# EAGLE design EXT_SCR (EAGLE 6.5.0)
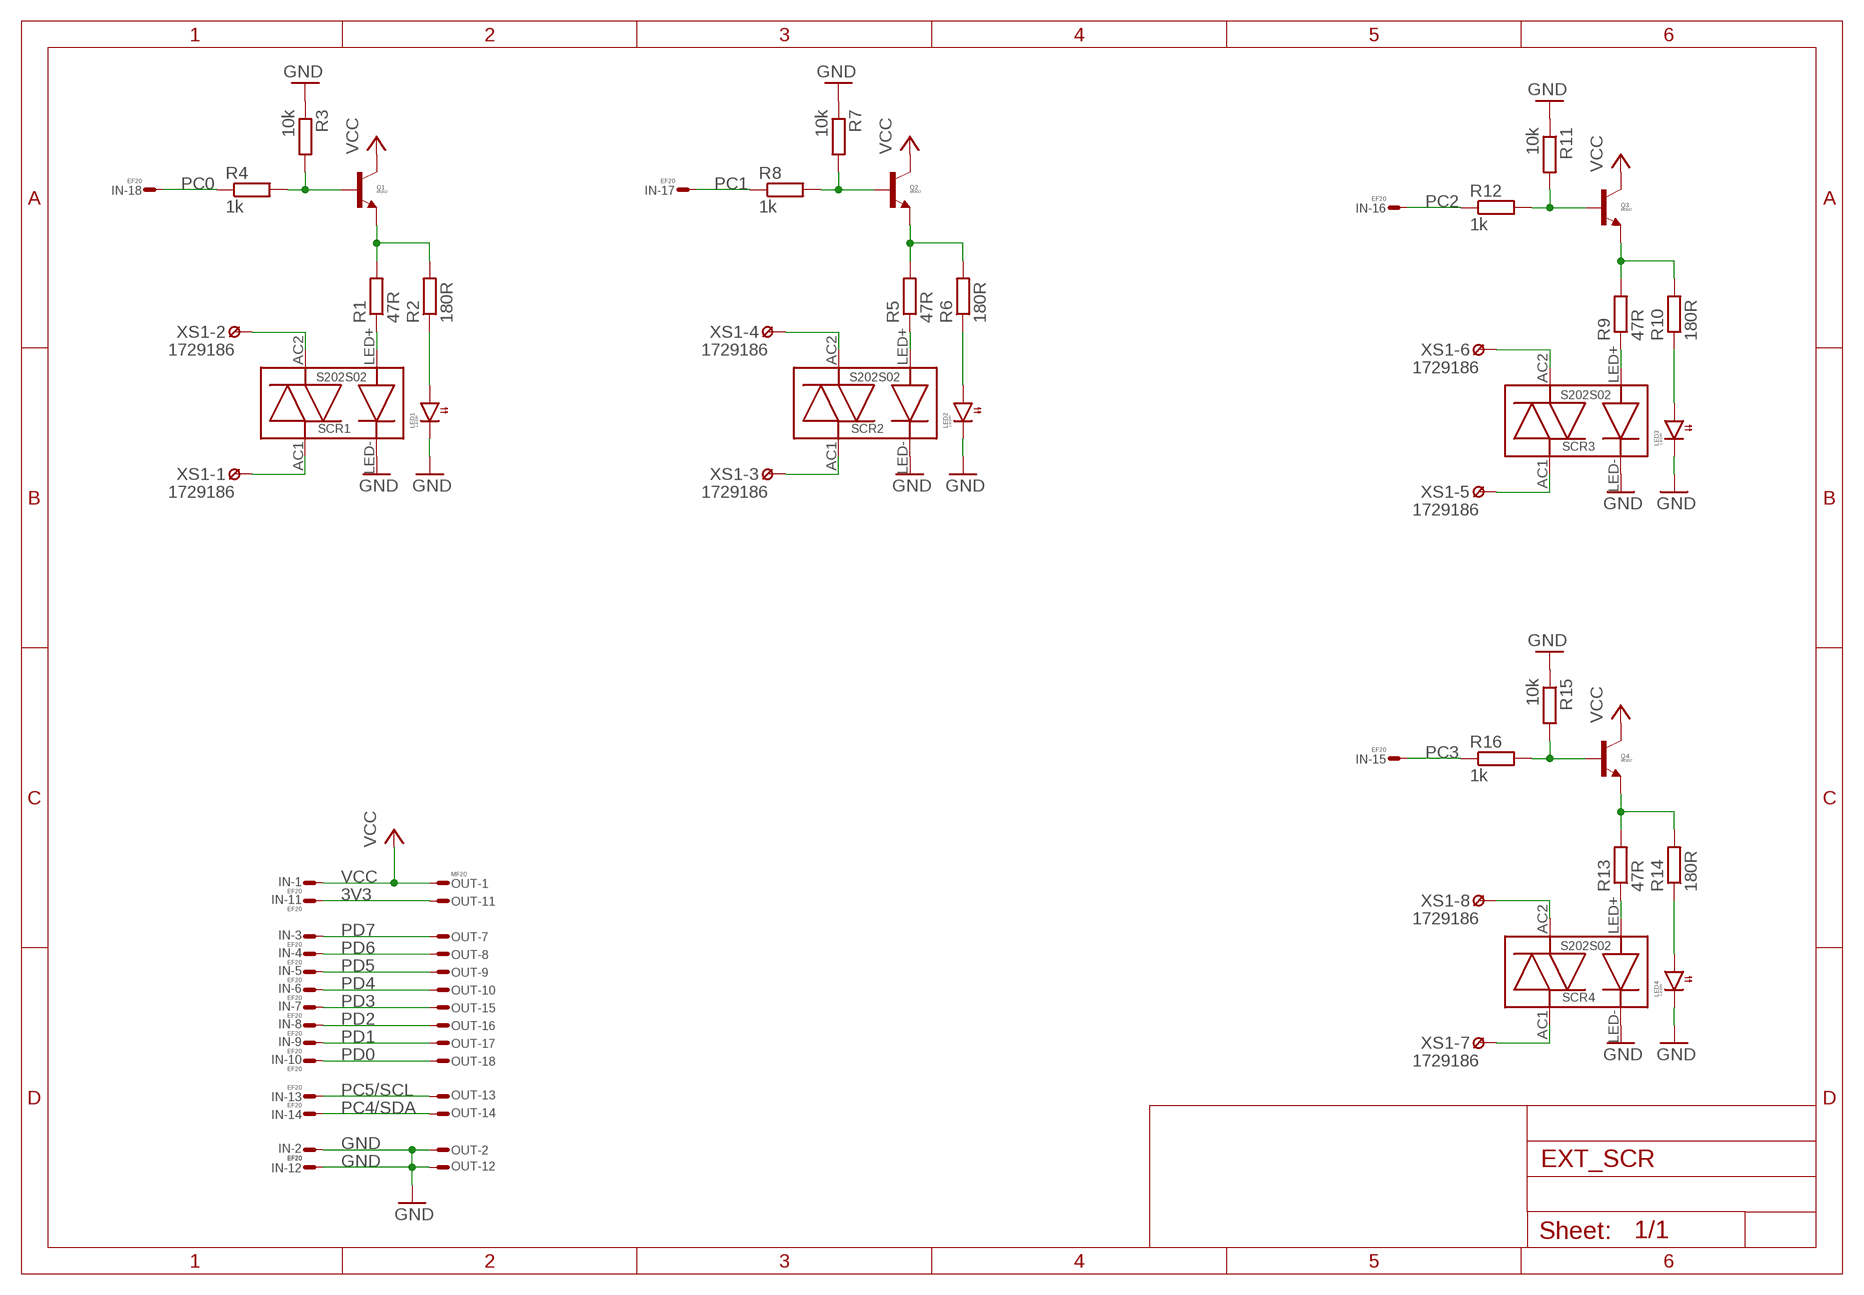
[diagram p0: schematic, sheet 1]

## Parts
IN  EF20  FE20ELSS  [FE10-2WSS]
LED1  LEDR  LED1206  [1206]
LED2  LEDR  LED1206  [1206]
LED3  LEDR  LED1206  [1206]
LED4  LEDR  LED1206  [1206]
OUT  MF20  ML20LSE  [ML20LS]
Q1  BC817  NPN23  [SOT23]
Q2  BC817  NPN23  [SOT23]
Q3  BC817  NPN23  [SOT23]
Q4  BC817  NPN23  [SOT23]
R1  47R  R0603  [0603]
R2  180R  R0603  [0603]
R3  10k  R0603  [0603]
R4  1k  R0603  [0603]
R5  47R  R0603  [0603]
R6  180R  R0603  [0603]
R7  10k  R0603  [0603]
R8  1k  R0603  [0603]
R9  47R  R0603  [0603]
R10  180R  R0603  [0603]
R11  10k  R0603  [0603]
R12  1k  R0603  [0603]
R13  47R  R0603  [0603]
R14  180R  R0603  [0603]
R15  10k  R0603  [0603]
R16  1k  R0603  [0603]
SCR1  S202S02  S202  [S202]
SCR2  S202S02  S202  [S202]
SCR3  S202S02  S202  [S202]
SCR4  S202S02  S202  [S202]
XS1  1729186  CON8-SS508  [W237-8P]

## Nets
3V3: IN.P$11 OUT.P$11
GND: IN.P$2 IN.P$12 LED1.2(C) LED2.2(C) LED3.2(C) LED4.2(C) OUT.P$2 OUT.P$12 R3.1 R7.1 R11.1 R15.1 SCR1.LED-(L-) SCR2.LED-(L-) SCR3.LED-(L-) SCR4.LED-(L-)
N$1: R1.1 SCR1.LED+(L+)
N$2: LED1.1(A) R2.1
N$3: Q1.2(E) R1.2 R2.2
N$4: Q1.1(B) R3.2 R4.2
N$5: R5.1 SCR2.LED+(L+)
N$6: LED2.1(A) R6.1
N$7: Q2.2(E) R5.2 R6.2
N$8: Q2.1(B) R7.2 R8.2
N$9: R9.1 SCR3.LED+(L+)
N$10: LED3.1(A) R10.1
N$11: Q3.2(E) R9.2 R10.2
N$12: Q3.1(B) R11.2 R12.2
N$13: R13.1 SCR4.LED+(L+)
N$14: LED4.1(A) R14.1
N$15: Q4.2(E) R13.2 R14.2
N$16: Q4.1(B) R15.2 R16.2
N$17: SCR1.AC1 XS1.1
N$18: SCR1.AC2 XS1.2
N$19: SCR2.AC1 XS1.3
N$20: SCR2.AC2 XS1.4
N$21: SCR3.AC1 XS1.5
N$22: SCR3.AC2 XS1.6
N$23: SCR4.AC2 XS1.8
N$24: SCR4.AC1 XS1.7
PC0: IN.P$18 R4.1
PC1: IN.P$17 R8.1
PC2: IN.P$16 R12.1
PC3: IN.P$15 R16.1
PC4/SDA: IN.P$14 OUT.P$14
PC5/SCL: IN.P$13 OUT.P$13
PD0: IN.P$10 OUT.P$18
PD1: IN.P$9 OUT.P$17
PD2: IN.P$8 OUT.P$16
PD3: IN.P$7 OUT.P$15
PD4: IN.P$6 OUT.P$10
PD5: IN.P$5 OUT.P$9
PD6: IN.P$4 OUT.P$8
PD7: IN.P$3 OUT.P$7
VCC: IN.P$1 OUT.P$1 Q1.3(C) Q2.3(C) Q3.3(C) Q4.3(C)
Unconnected: IN.P$19 IN.P$20 OUT.P$3 OUT.P$4 OUT.P$5 OUT.P$6 OUT.P$19 OUT.P$20

## Library data of the parts
IN = Conn:FE20E
LED1-LED4 = Optic:LED
OUT = Conn:ML20?E: HARTING
Q1-Q4 = Transistor:NPN
R1-R16 = RCL:R: Resistor SMD
SCR1-SCR4 = Relay_Switch:S202
XS1 = Conn:CON8-S

## Board
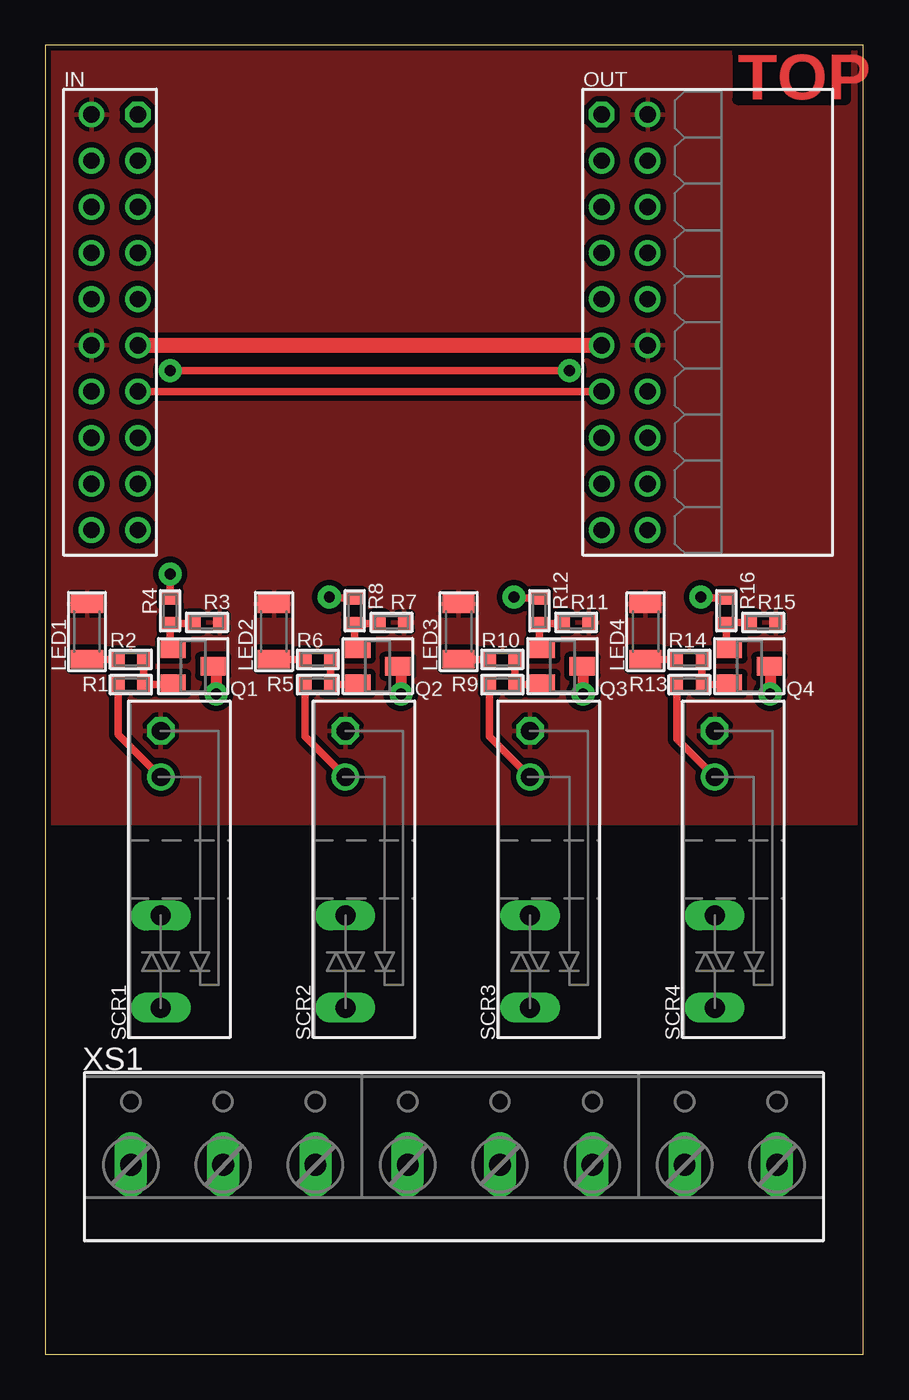
[diagram p1: board, top side]
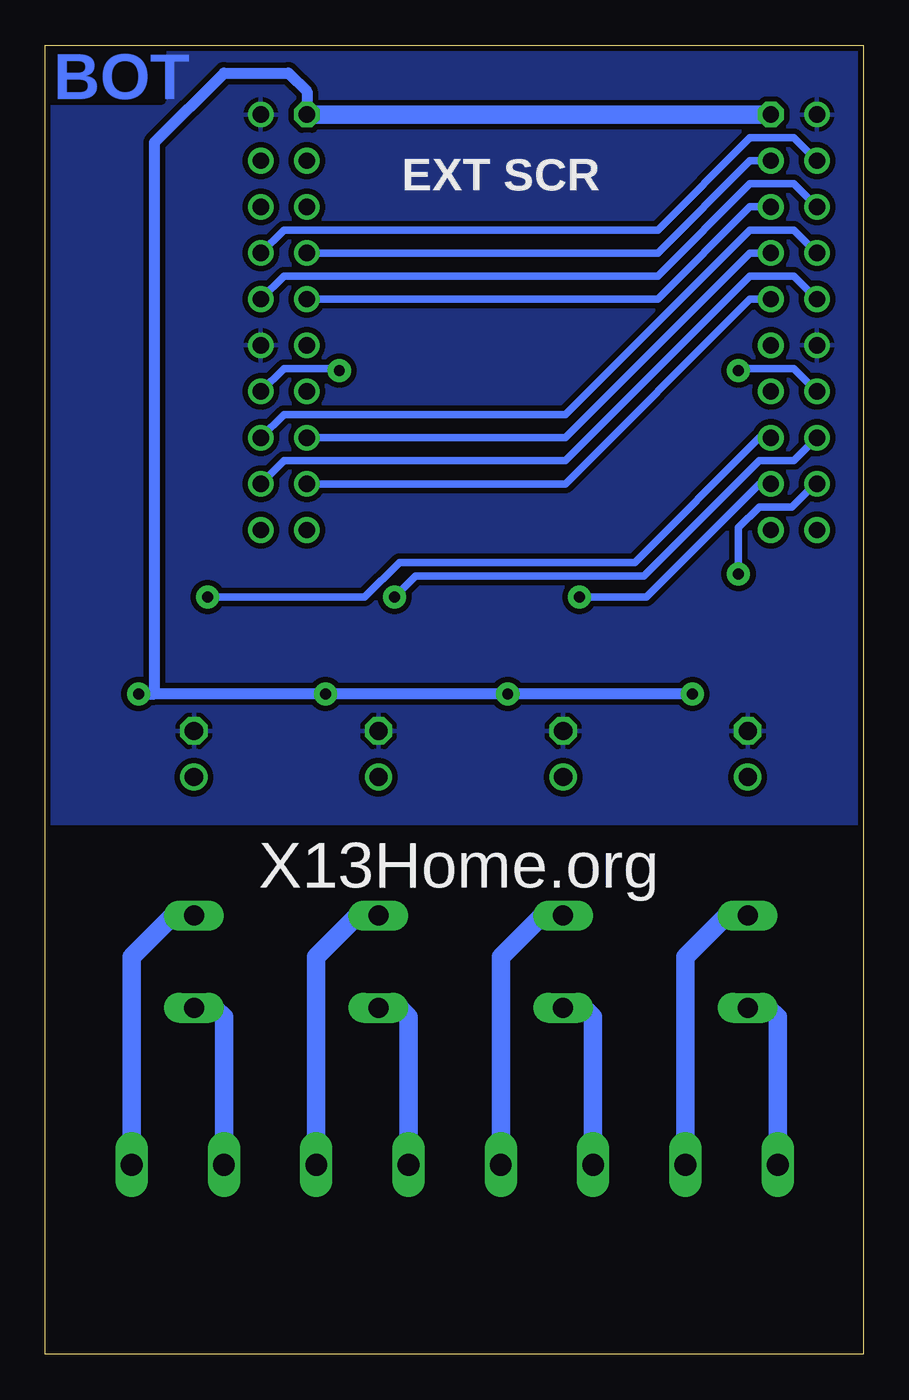
[diagram p2: board, bottom side, seen from below]

Size 45 x 72 mm. Coordinates in mm from the lower left corner, seen from the top.
Outline: 0,0 45,0 45,72 0,72 0,0
Copper layers (1*16): Top 0.035mm / dielectric 1.5mm / Bottom 0.035mm
Design rules "default *": minimum track width 10mil, minimum drill 10mil, track to track 12mil, track to pad 12mil, pad to pad 12mil, via to via 12mil, smd to smd 12mil, copper to edge 12mil, drill to drill 8mil, minimum pad ring 10mil, minimum via ring 8mil, stop-mask expansion 4mil, vias tented up to drill 0mil, thermal gap 10mil
tKeepout: area 0,0 to 45,2; area 0,70 to 45,72

### Footprints (pad centres in the part's own frame; a part is rotated, then mirrored left to right if it is on the bottom)
FE10-2WSS = drill 0.9 octagon: P$1 -11.43,1.27 | drill 0.9: P$2 -11.43,-1.27; P$3 -8.89,1.27; P$4 -8.89,-1.27; P$5 -6.35,1.27; P$6 -6.35,-1.27; P$7 -3.81,1.27; P$8 -3.81,-1.27; P$9 -1.27,1.27; P$10 -1.27,-1.27; P$11 1.27,1.27; P$12 1.27,-1.27; P$13 3.81,1.27; P$14 3.81,-1.27; P$15 6.35,1.27; P$16 6.35,-1.27; P$17 8.89,1.27; P$18 8.89,-1.27; P$19 11.43,1.27; P$20 11.43,-1.27
1206 = smd 1.016 x 1.778: 1 -1.524,0; 2 1.524,0
ML20LS = drill 0.9 octagon: P$1 -11.43,-1.27 | drill 0.9: P$2 -11.43,1.27; P$3 -8.89,-1.27; P$4 -8.89,1.27; P$5 -6.35,-1.27; P$6 -6.35,1.27; P$7 -3.81,-1.27; P$8 -3.81,1.27; P$9 -1.27,-1.27; P$10 -1.27,1.27; P$11 1.27,-1.27; P$12 1.27,1.27; P$13 3.81,-1.27; P$14 3.81,1.27; P$15 6.35,-1.27; P$16 6.35,1.27; P$17 8.89,-1.27; P$18 8.89,1.27; P$19 11.43,-1.27; P$20 11.43,1.27
SOT23 = smd 1 x 1.4: 1 -0.95,-1.1; 2 0.95,-1.1; 3 0,1.1
0603 = smd 0.7 x 0.9: 1 -0.697,0; 2 0.697,0
S202 = drill 1.1 long: AC1 -7.62,0; AC2 -2.54,0 | drill 1: LED+ 5.08,0 | drill 1 octagon: LED- 7.62,0
W237-8P = drill 1.194 long: 1 -17.78,-0.635; 2 -12.7,-0.635; 3 -7.62,-0.635; 4 -2.54,-0.635; 5 2.54,-0.635; 6 7.62,-0.635; 7 12.7,-0.635; 8 17.78,-0.635

### Placement (x,y rotation side)
IN  3.81,56.77 270 top
LED1  2.29,39.75 90 top
LED2  12.57,39.75 90 top
LED3  22.73,39.75 90 top
LED4  33.02,39.75 90 top
OUT  31.88,56.77 270 top
Q1  8.13,37.85 270 top
Q2  18.29,37.85 270 top
Q3  28.45,37.85 270 top
Q4  38.73,37.85 270 top
R1  4.7,36.83 0 top
R2  4.7,38.23 0 top
R3  8.89,40.26 180 top
R4  6.86,40.89 270 top
R5  14.99,36.83 0 top
R6  14.99,38.23 0 top
R7  19.05,40.26 180 top
R8  17.02,40.89 270 top
R9  25.15,36.83 0 top
R10  25.15,38.23 0 top
R11  29.21,40.26 180 top
R12  27.18,40.89 270 top
R13  35.43,36.83 0 top
R14  35.43,38.23 0 top
R15  39.5,40.26 180 top
R16  37.47,40.89 270 top
SCR1  6.35,26.67 90 top
SCR2  16.51,26.67 90 top
SCR3  26.67,26.67 90 top
SCR4  36.83,26.67 90 top
XS1  22.48,11.05 0 top

### Tracks (layer width: path | path; a pad name or v marks a point on that pad's centre or on a via)
3V3
  Top 0.813: IN.P$11 OUT.P$11
GND
  pour Bottom: 0,29.21 45,29.21 45,72 0,72
  pour Top: 0,29.21 45,29.21 45,72 0,72
N$1
  Top 0.406: R1.1 4,34.1 SCR1.LED+
N$2
  Top 0.406: R2.1 LED1.1
N$3
  Top 0.406: Q1.2 6.96,36.83 R1.2 R2.2
N$4
  Top 0.406: Q1.1 6.86,38.97 R4.2 8.13,40.2 R3.2
N$5
  Top 0.406: R5.1 14.29,33.97 SCR2.LED+
N$6
  Top 0.406: R6.1 LED2.1
N$7
  Top 0.406: R6.2 R5.2 17.12,36.83 Q2.2
N$8
  Top 0.406: Q2.1 17.02,38.97 R8.2 18.29,40.2 R7.2
N$9
  Top 0.406: R9.1 24.45,33.97 SCR3.LED+
N$10
  Top 0.406: LED3.1 R10.1
N$11
  Top 0.406: R10.2 R9.2 27.28,36.83 Q3.2
N$12
  Top 0.406: Q3.1 27.18,38.97 R12.2 28.45,40.2 R11.2
N$13
  Top 0.406: R13.1 34.74,33.84 SCR4.LED+
N$14
  Top 0.406: R14.1 LED4.1
N$15
  Top 0.406: R14.2 R13.2 37.57,36.83 Q4.2
N$16
  Top 0.406: R15.2 37.53,40.26 R16.2 37.47,38.97 Q4.1
N$17
  Bottom 1.016: XS1.1 4.7,18.54 5.21,19.05 SCR1.AC1
N$18
  Bottom 1.016: XS1.2 9.78,21.84 7.49,24.13 SCR1.AC2
N$19
  Bottom 1.016: XS1.3 14.86,18.54 15.37,19.05 SCR2.AC1
N$20
  Bottom 1.016: XS1.4 19.94,21.84 17.65,24.13 SCR2.AC2
N$21
  Bottom 1.016: XS1.5 25.02,18.54 25.53,19.05 SCR3.AC1
N$22
  Bottom 1.016: XS1.6 30.1,21.84 27.81,24.13 SCR3.AC2
N$23
  Bottom 1.016: XS1.8 40.26,21.84 37.97,24.13 SCR4.AC2
N$24
  Bottom 1.016: XS1.7 35.18,18.54 35.69,19.05 SCR4.AC1
PC0  (via drill 0.6 pad 1.27)
  Top 0.406: v6.86,42.93 R4.1
  Bottom 0.406: IN.P$18 2.67,47.88 3.94,46.61 5.71,46.61 6.86,45.47 v6.86,42.93
PC1  (via drill 0.6 pad 1.27)
  Top 0.406: R8.1 15.69,41.59 v15.62,41.66
  Bottom 0.406: v15.62,41.66 11.94,41.66 5.71,47.88 IN.P$17
PC2  (via drill 0.6 pad 1.27)
  Top 0.406: R12.1 25.85,41.59 v25.78,41.66
  Bottom 0.406: v25.78,41.66 24.64,42.8 12.06,42.8 5.71,49.15 3.81,49.15 IN.P$16
PC3  (via drill 0.6 pad 1.27)
  Top 0.406: R16.1 36.13,41.59 v36.07,41.66
  Bottom 0.406: IN.P$15 5.71,50.42 12.57,43.56 25.53,43.56 27.43,41.66 v36.07,41.66
PC4/SDA  (via drill 0.6 pad 1.27)
  Top 0.406: v6.86,54.1 v28.83,54.1
  Bottom 0.406: IN.P$14 3.81,54.23 6.73,54.23 v6.86,54.1 | OUT.P$14 31.88,54.23 28.96,54.23 v28.83,54.1
PC5/SCL
  Top 0.406: IN.P$13 OUT.P$13
PD0
  Bottom 0.406: IN.P$10 3.81,59.31 6.22,59.31 16.38,49.15 31.88,49.15 OUT.P$18
PD1
  Bottom 0.406: IN.P$9 6.22,58.04 16.38,47.88 OUT.P$17
PD2
  Bottom 0.406: IN.P$8 3.81,61.85 6.22,61.85 16.38,51.69 31.88,51.69 OUT.P$16
PD3
  Bottom 0.406: IN.P$7 6.22,60.58 16.38,50.42 OUT.P$15
PD4
  Bottom 0.406: IN.P$6 3.81,64.39 6.22,64.39 11.3,59.31 31.88,59.31 OUT.P$10
PD5
  Bottom 0.406: IN.P$5 6.22,63.12 11.3,58.04 OUT.P$9
PD6
  Bottom 0.406: IN.P$4 3.81,66.93 6.22,66.93 11.3,61.85 31.88,61.85 OUT.P$8
PD7
  Bottom 0.406: IN.P$3 6.22,65.66 11.3,60.58 OUT.P$7
VCC  (via drill 0.6 pad 1.27)
  Top 0.406: Q1.3 9.4,37.85 | Q2.3 19.56,37.85 | Q3.3 29.59,37.85 | Q4.3 39.88,37.85
  Top 0.61: 9.4,37.85 v9.4,36.32 | 19.56,37.85 v19.56,36.32 | 29.59,37.85 v29.59,36.32 | 39.88,37.85 v39.88,36.32
  Bottom 0.61: v9.4,36.32 v19.56,36.32 v29.59,36.32 38.99,36.32 | OUT.P$1 30.61,69.47 31.62,70.48 35.18,70.48 38.99,66.67 38.99,36.32 | v39.88,36.32 38.99,36.32
  Bottom 1.016: IN.P$1 OUT.P$1

### Text on the board
Top: TOP
Bottom: BOT
bNames: EXT SCR | X13Home.org